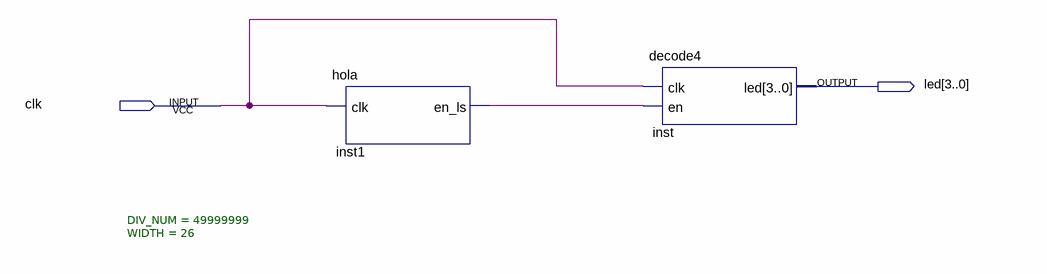
[diagram p0: schematic sheet]
// Quartus schematic Block4.bdf as structural Verilog: 2 symbols, 2 pins
module Block4 (
  input  clk,
  output [3:0] led
);

  wire inst1_en_ls;

  hola #(.DIV_NUM(49999999), .WIDTH(26)) inst1 (.clk(clk), .en_ls(inst1_en_ls));
  decode4 inst (.clk(clk), .en(inst1_en_ls), .led(led));
endmodule
